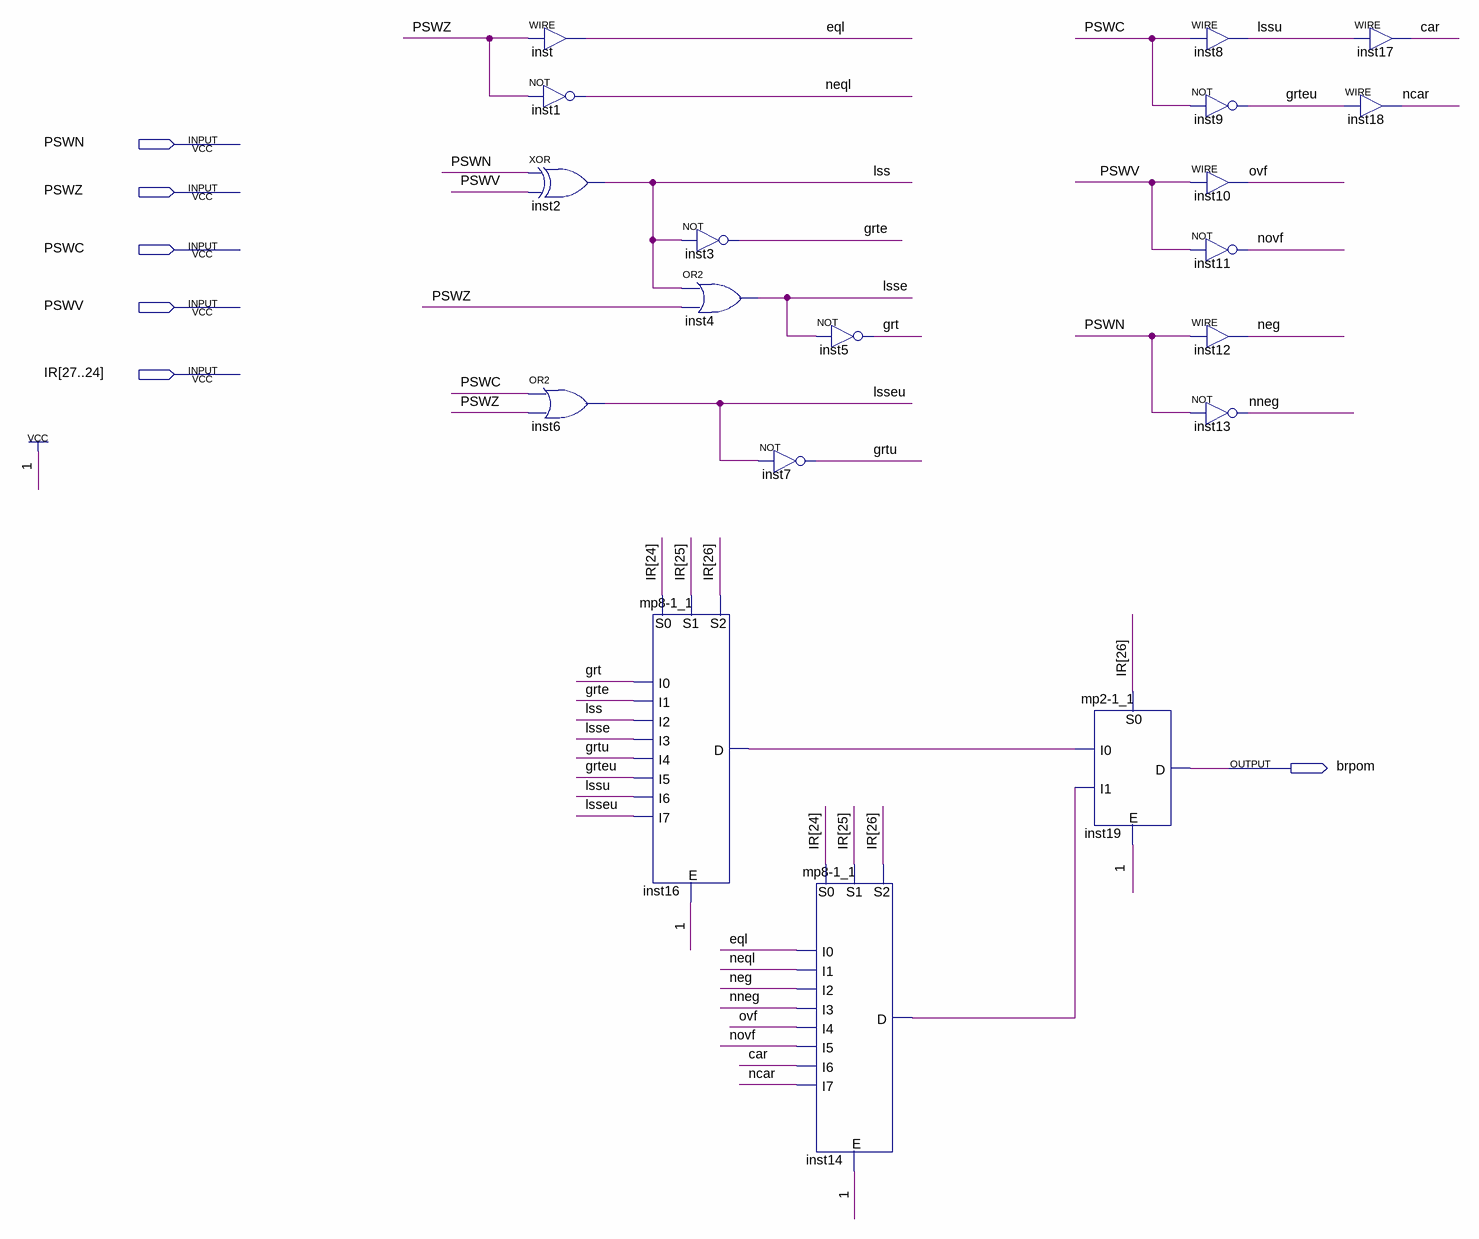
[diagram p0: schematic sheet]
// Quartus schematic Branch_condition.bdf as structural Verilog: 19 symbols, 6 pins
module Branch_condition (
  input  PSWN,
  input  PSWZ,
  input  PSWC,
  input  PSWV,
  input  [27:24] IR,
  output brpom
);

  wire car, eql, grt, grte, grteu, grtu, inst14_d, inst16_d, lss, lsse, lsseu, lssu, ncar, neg, neql, nneg,
       novf, ovf;

  assign eql = PSWZ;  // WIRE inst
  not inst1 (neql, PSWZ);
  xor inst2 (lss, PSWN, PSWV);
  or inst6 (lsseu, PSWC, PSWZ);
  not inst3 (grte, lss);
  or inst4 (lsse, lss, PSWZ);
  \mp8-1_1  inst16 (
    .I0(grt), .I1(grte), .I2(lss), .I3(lsse), .I4(grtu), .I5(grteu), .I6(lssu), .I7(lsseu), .S0(IR[24]),
    .S1(IR[25]), .S2(IR[26]), .D(inst16_d));  // open: E
  not inst7 (grtu, lsseu);
  not inst5 (grt, lsse);
  \mp8-1_1  inst14 (
    .E(1'b1), .I0(eql), .I1(neql), .I2(neg), .I3(nneg), .I4(ovf), .I5(novf), .I6(car), .I7(ncar),
    .S0(IR[24]), .S1(IR[25]), .S2(IR[26]), .D(inst14_d));
  \mp2-1_1  inst19 (.E(1'b1), .I0(inst16_d), .I1(inst14_d), .S0(IR[26]), .D(brpom));
  assign lssu = PSWC;  // WIRE inst8
  not inst9 (grteu, PSWC);
  assign ovf = PSWV;  // WIRE inst10
  not inst11 (novf, PSWV);
  assign neg = PSWN;  // WIRE inst12
  not inst13 (nneg, PSWN);
  assign car = lssu;  // WIRE inst17
  assign ncar = grteu;  // WIRE inst18
endmodule
